# Altium schematic sheet Sheet_1_2024-09-22.schdoc
size 379 x 220 mm
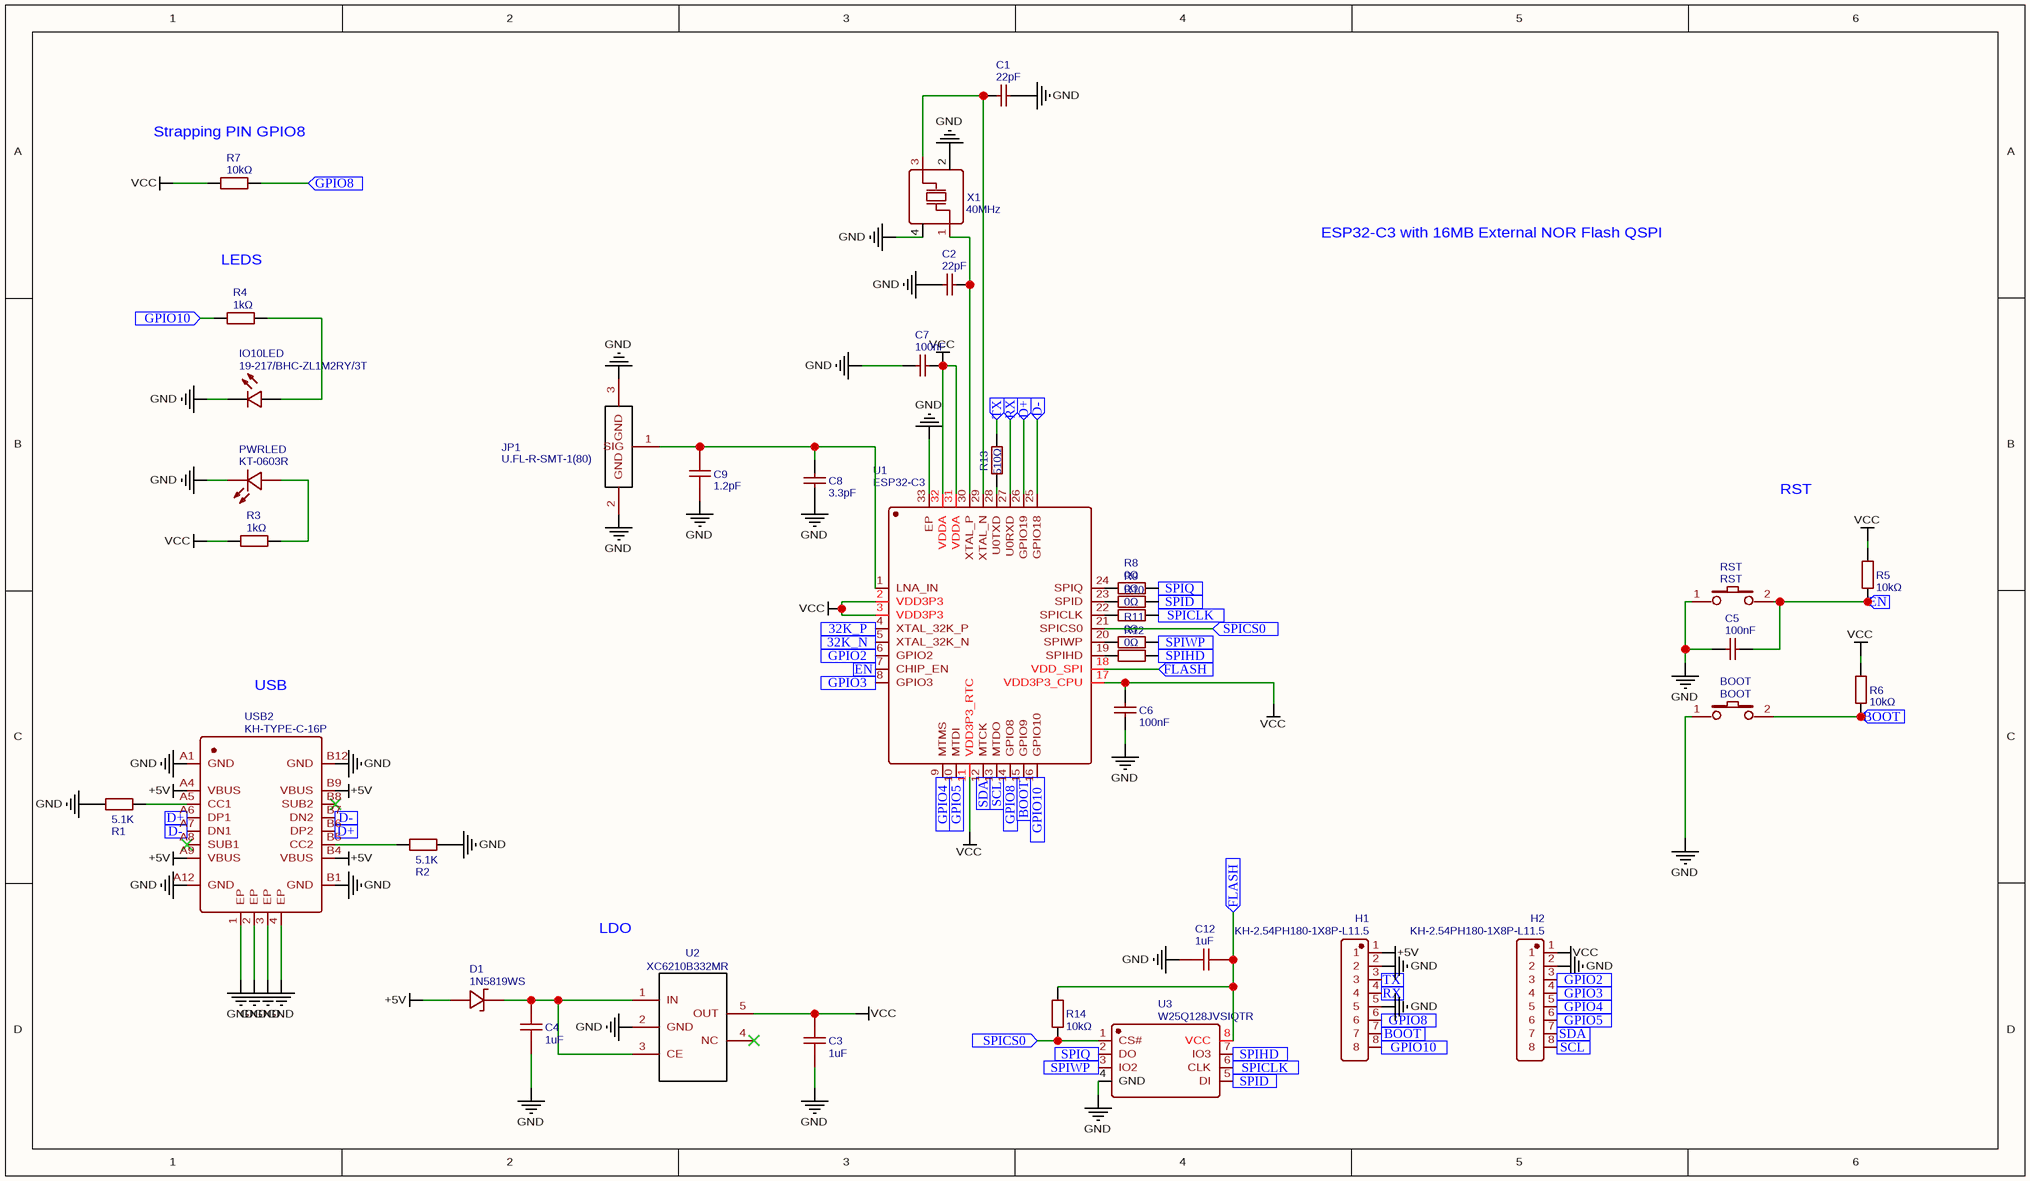
[diagram p0: Sheet_1_2024-09-22.schdoc]

## Parts
BOOT  BOOT  [SW-SMD_L3.9-W3.0-P4.45]
C1  22pF  [C0402]
C2  22pF  [C0402]
C3  1uF  [C0402]
C4  1uF  [C0402]
C5  100nF  [C0402_NEW]
C6  100nF  [C0402_NEW]
C7  100nF  [C0402_NEW]
C8  3.3pF  [C0402]
C9  1.2pF  [C0402]
C12  1uF  [C0402]
D1  1N5819WS  [SOD-323_L1.8-W1.3-LS2.5-RD]
H1  KH-2.54PH180-1X8P-L11.5  [HDR-TH_8P-P2.54-V-M]
H2  KH-2.54PH180-1X8P-L11.5  [HDR-TH_8P-P2.54-V-M]
IO10LED  19-217/BHC-ZL1M2RY/3T  [LED0603-R-RD_BLUE]
JP1  U.FL-R-SMT-1(80)  [RF-SMD_FRF05002-JSS103M]
PWRLED  KT-0603R  [LED0603-R-RD]
R1  5.1K  [R0402]
R2  5.1K  [R0402]
R3  1kΩ  [R0402]
R4  1kΩ  [R0402]
R5  10kΩ  [R0402]
R6  10kΩ  [R0402]
R7  10kΩ  [R0402]
R8  0Ω  [R0402]
R9  0Ω  [R0402]
R10  0Ω  [R0402]
R11  0Ω  [R0402]
R12  0Ω  [R0402]
R13  510Ω  [R0402]
R14  10kΩ  [R0402]
RST  RST  [SW-SMD_L3.9-W3.0-P4.45]
U1  ESP32-C3  [QFN-32_L5.0-W5.0-P0.50-TL-EP3.7]
U2  XC6210B332MR  [SOT-23-5_L3.0-W1.7-P0.95-LS2.8-BR]
U3  W25Q128JVSIQTR  [SOIC-8_L5.3-W5.3-P1.27-LS8.0-BL]
USB2  KH-TYPE-C-16P  [USB-C-SMD_KH-TYPE-C-16P]
X1  40MHz  [CRYSTAL-SMD_4P-L3.2-W2.5-BL]

## Ports
32K_N (in), 32K_P (in), BOOT (in), D+ (in), D- (in), EN (in), FLASH (in), GPIO2 (in), GPIO3 (in), GPIO4 (in), GPIO5 (in), GPIO8 (in), GPIO10 (in), RX (in), SCL (in), SDA (in), SPICLK (in), SPICS0 (in), SPID (in), SPIHD (in), SPIQ (in), SPIWP (in), TX (in)

## Nets
+5V: D1.2(A) H1.1 USB2.A4(VBUS) USB2.A9(VBUS) USB2.B4(VBUS) USB2.B9(VBUS)
GND: BOOT.1 C1.1 C2.1 C3.1 C4.1 C5.2 C6.2 C7.1 C8.1 C9.1 C12.1 H1.2 H1.5 H2.2 IO10LED.2(C) JP1.2(GND) JP1.3(GND) PWRLED.2(K) R1.1 R2.2 RST.1 U1.33(EP) U2.2(GND) U3.4(GND) USB2.1(EP) USB2.2(EP) USB2.3(EP) USB2.4(EP) USB2.A1(GND) USB2.A12(GND) USB2.B1(GND) USB2.B12(GND) X1.2(GND) X1.4(GND)
VCC: C3.2 C6.1 C7.2 H2.1 R3.1 R5.1 R6.1 R7.1 U1.2(VDD3P3) U1.3(VDD3P3) U1.11(VDD3P3_RTC) U1.17(VDD3P3_CPU) U1.31(VDDA) U1.32(VDDA) U2.5(OUT)
32K_N: U1.5(XTAL_32K_N) ; port 32K_N
32K_P: U1.4(XTAL_32K_P) ; port 32K_P
BOOT: BOOT.2 H1.7 R6.2 U1.15(GPIO9) ; port BOOT
D+: U1.26(GPIO19) USB2.A6(DP1) USB2.B6(DP2) ; port D+
D-: U1.25(GPIO18) USB2.A7(DN1) USB2.B7(DN2) ; port D-
EN: C5.1 R5.2 RST.2 U1.7(CHIP_EN) ; port EN
FLASH: C12.2 R14.2 U1.18(VDD_SPI) U3.8(VCC) ; port FLASH
GPIO2: H2.3 U1.6(GPIO2) ; port GPIO2
GPIO3: H2.4 U1.8(GPIO3) ; port GPIO3
GPIO4: H2.5 U1.9(MTMS) ; port GPIO4
GPIO5: H2.6 U1.10(MTDI) ; port GPIO5
GPIO8: H1.6 R7.2 U1.14(GPIO8) ; port GPIO8
GPIO10: H1.8 R4.1 U1.16(GPIO10) ; port GPIO10
RX: H1.4 U1.27(U0RXD) ; port RX
SCL: H2.8 U1.13(MTDO) ; port SCL
SDA: H2.7 U1.12(MTCK) ; port SDA
SPICLK: R10.2 U3.6(CLK) ; port SPICLK
SPICS0: R14.1 U1.21(SPICS0) U3.1(CS#) ; port SPICS0
SPID: R9.2 U3.5(DI) ; port SPID
SPIHD: R12.2 U3.7(IO3) ; port SPIHD
SPIQ: R8.2 U3.2(DO) ; port SPIQ
SPIWP: R11.2 U3.3(IO2) ; port SPIWP
TX: H1.3 R13.2 ; port TX
NetC1_2: C1.2 U1.29(XTAL_N) X1.3(OSC2)
NetC2_2: C2.2 U1.30(XTAL_P) X1.1(OSC1)
NetC4_2: C4.2 D1.1(C) U2.1(IN) U2.3(CE)
NetC8_2: C8.2 C9.2 JP1.1(SIG) U1.1(LNA_IN)
NetIO10LED_1: IO10LED.1(A) R4.2
NetPWRLED_1: PWRLED.1(A) R3.2
NetR1_2: R1.2 USB2.A5(CC1)
NetR2_1: R2.1 USB2.B5(CC2)
NetR8_1: R8.1 U1.24(SPIQ)
NetR9_1: R9.1 U1.23(SPID)
NetR10_1: R10.1 U1.22(SPICLK)
NetR11_1: R11.1 U1.20(SPIWP)
NetR12_1: R12.1 U1.19(SPIHD)
NetR13_1: R13.1 U1.28(U0TXD)

Not connected (* = marked no-connect by the designer): U2 4(NC)*; USB2 A8(SUB1)* B8(SUB2)*

## Notes on the sheet
- (near R7) Strapping PIN GPIO8
- ESP32-C3 with 16MB External NOR Flash QSPI
- LEDS
- RST
- USB
- LDO

## Library data of the parts
BOOT = BOOT: Manufacturer: XUNPU; Manufacturer Part: TS-1088R-02026; Supplier Part: C455280; Supplier: LCSC; spicePre: K
C1 C2 = 22pF: Manufacturer: FH; Manufacturer Part: 0402CG220J500NT; nameAlias: Capacitance; Supplier: LCSC; Supplier Part: C1555; JLCPCB Part Class: Basic Part; spicePre: C; spiceSymbolName: 0402CG220J500NT
C3 C4 C12 = 1uF: Manufacturer: SAMSUNG; Manufacturer Part: CL05A105KA5NQNC; nameAlias: Capacitance; Supplier: LCSC; Supplier Part: C52923; JLCPCB Part Class: Basic Part; spicePre: C; spiceSymbolName: CL05A105KA5NQNC
C5-C7 = 100nF: Manufacturer Part: CL05B104KO5NNNC; Manufacturer: SAMSUNG; nameAlias: Capacitance; Supplier: LCSC; Supplier Part: C1525; JLCPCB Part Class: Basic Part; spicePre: C; spiceSymbolName: CL05B104KO5NNNC
C8 = 3.3pF: Manufacturer: FH; Manufacturer Part: 0402CG3R3C500NT; nameAlias: Capacitance; Supplier: LCSC; Supplier Part: C1565; JLCPCB Part Class: Basic Part; spicePre: C; spiceSymbolName: 0402CG3R3C500NT
C9 = 1.2pF: Manufacturer: VIIYONG; Manufacturer Part: V1R2C0402C0G500NBT; nameAlias: Capacitance; Contributor: LCSC; Supplier: LCSC; Supplier Part: C610055; JLCPCB Part Class: Extended Part; spicePre: C; spiceSymbolName: V1R2C0402C0G500NBT
D1 = 1N5819WS: Manufacturer: Guangdong Hottech; Contributor: LCSC; Supplier: LCSC; Supplier Part: C191023; Manufacturer Part: 1N5819WS; JLCPCB Part Class: Basic Part; spicePre: D; spiceSymbolName: 1N5819WS
H1 H2 = KH-2.54PH180-1X8P-L11.5: Manufacturer: kinghelm(金航标); Contributor: LCSC; Supplier: LCSC; Supplier Part: C2905487; Manufacturer Part: KH-2.54PH180-1X8P-L11.5; JLCPCB Part Class: Extended Part; spicePre: H; spiceSymbolName: KH-2.54PH180-1X8P-L11.5
IO10LED = 19-217/BHC-ZL1M2RY/3T: Manufacturer: EVERLIGHT(台湾亿光); Supplier: LCSC; Manufacturer Part: 19-217/BHC-ZL1M2RY/3T; Supplier Part: C72041; JLCPCB Part Class: Basic Part; spicePre: L; spiceSymbolName: 19-217/BHC-ZL1M2RY/3T
JP1 = U.FL-R-SMT-1(80): Manufacturer: HRS; Supplier: LCSC; Manufacturer Part: U.FL-R-SMT-1(80); Supplier Part: C88374; JLCPCB Part Class: Extended Part; spicePre: J; spiceSymbolName: U.FL-R-SMT-1(80)
PWRLED = KT-0603R: Manufacturer: KENTO; Supplier: LCSC; Manufacturer Part: KT-0603R; Supplier Part: C2286; JLCPCB Part Class: Basic Part; spicePre: L; spiceSymbolName: KT-0603R
R1 R2 = 5.1K: Manufacturer: UniOhm; Manufacturer Part: 0402WGF5101TCE; nameAlias: Resistance (Ohms); Supplier: LCSC; Supplier Part: C25905; JLCPCB Part Class: Basic Part; spicePre: R; spiceSymbolName: 0402WGF5101TCE
R3 R4 = 1kΩ: Manufacturer: UNI-ROYAL(厚声); Manufacturer Part: 0402WGF1001TCE; nameAlias: Resistance; Resistance (Ohms): 1K; Supplier: LCSC; Supplier Part: C11702; JLCPCB Part Class: Basic Part; spicePre: R; spiceSymbolName: 0402WGF1001TCE
R5-R7 R14 = 10kΩ: Manufacturer: UniOhm; Manufacturer Part: 0402WGF1002TCE; nameAlias: Resistance; Resistance (Ohms): 10K; Supplier: LCSC; Supplier Part: C25744; JLCPCB Part Class: Basic Part; spicePre: R; spiceSymbolName: 0402WGF1002TCE
R8-R12 = 0Ω: Manufacturer: UNI-ROYAL(厚声); Manufacturer Part: 0402WGF0000TCE; nameAlias: Resistance; Resistance (Ohms): 0; Supplier: LCSC; Supplier Part: C17168; JLCPCB Part Class: Basic Part; spicePre: R; spiceSymbolName: 0402WGF0000TCE
R13 = 510Ω: Manufacturer: UniOhm; Manufacturer Part: 0402WGF5100TCE; nameAlias: Resistance; Resistance (Ohms): 510; Supplier: LCSC; Supplier Part: C25123; JLCPCB Part Class: Basic Part; spicePre: R; spiceSymbolName: 0402WGF5100TCE
RST = RST: Manufacturer: XUNPU; Manufacturer Part: TS-1088R-02026; Supplier Part: C455280; Supplier: LCSC; spicePre: K
U1 = ESP32-C3: Manufacturer: ESPRESSIF 乐鑫; Contributor: LCSC; Supplier: LCSC; Supplier Part: C2838500; Manufacturer Part: ESP32-C3; JLCPCB Part Class: Extended Part; spicePre: U; spiceSymbolName: ESP32-C3
U2 = XC6210B332MR: Manufacturer: TOREX(特瑞仕); Manufacturer Part: XC6210B332MR-G; Supplier: LCSC; Supplier Part: C47719; JLCPCB Part Class: Extended Part; spicePre: U; spiceSymbolName: XC6210B332MR
U3 = W25Q128JVSIQTR: Manufacturer: WINBOND(华邦); Supplier: LCSC; Manufacturer Part: W25Q128JVSIQ; Supplier Part: C97521; JLCPCB Part Class: Basic Part; spicePre: U; spiceSymbolName: W25Q128JVSIQTR
USB2 = KH-TYPE-C-16P: Manufacturer: Shenzhen Kinghelm Elec; Contributor: LCSC; Supplier: LCSC; Supplier Part: C709357; Manufacturer Part: KH-TYPE-C-16P; JLCPCB Part Class: Extended Part; spicePre: U; spiceSymbolName: KH-TYPE-C-16P
X1 = 40MHz: Manufacturer: JGHC(晶光华); Manufacturer Part: S3240000151040; nameAlias: Frequency; Contributor: LCSC; Supplier: LCSC; Supplier Part: C426990; JLCPCB Part Class: Extended Part; spicePre: X; spiceSymbolName: S3240000151040